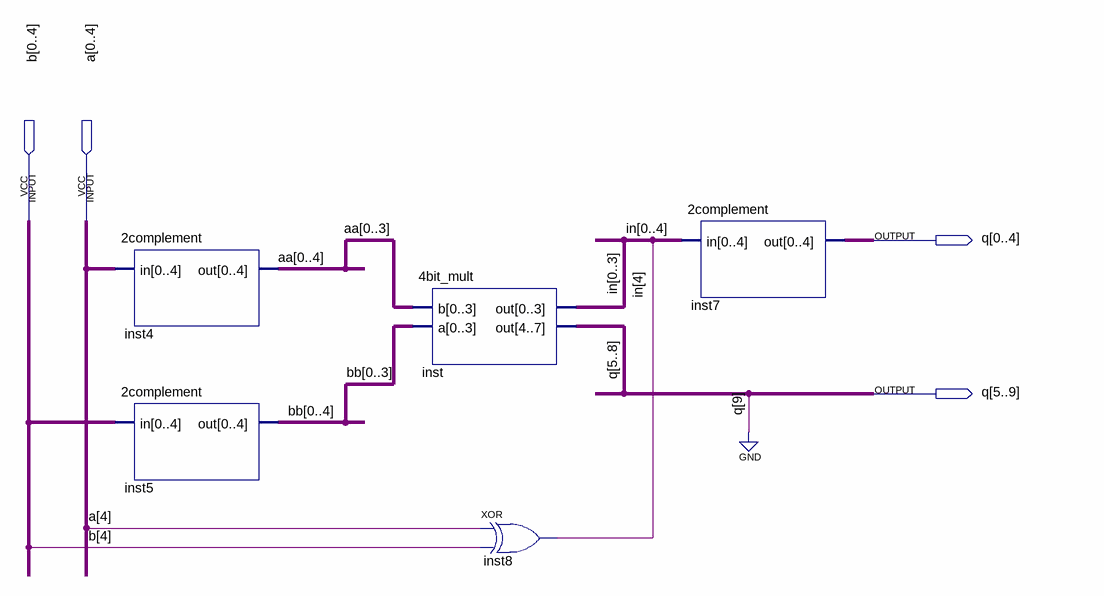
[diagram p0: schematic sheet]
// Quartus schematic 5bit_mut.bdf as structural Verilog: 5 symbols, 4 pins
module \5bit_mut  (
  input  [0:4] b,
  input  [0:4] a,
  output [0:9] q
);

  wire [4:0] aa, bb, in;

  \2complement  inst4 (.in(a), .out({aa[0], aa[1], aa[2], aa[3], aa[4]}));
  \2complement  inst5 (.in(b), .out({bb[0], bb[1], bb[2], bb[3], bb[4]}));
  \4bit_mult  inst (
    .b({aa[0], aa[1], aa[2], aa[3]}), .a({bb[0], bb[1], bb[2], bb[3]}),
    .out({q[8], q[7], q[6], q[5], in[3:0]}));
  xor inst8 (in[4], a[4], b[4]);
  \2complement  inst7 (.in({in[0], in[1], in[2], in[3], in[4]}), .out(q[0:4]));

  assign q[9] = 1'b0;
endmodule
